# Altium schematic sheet EVK-NORA-W4_SCHEM_0003_USBhub_FTDI.SchDoc
size A3; Date: 04/04/2024; CompanyName: U-blox; DrawnBy: ASOH; Engineer: ASOH; Organization: U-blox; SheetNumber: 4; SheetTotal: 6; SheetSize: B; SheetTitle: Interface MCU
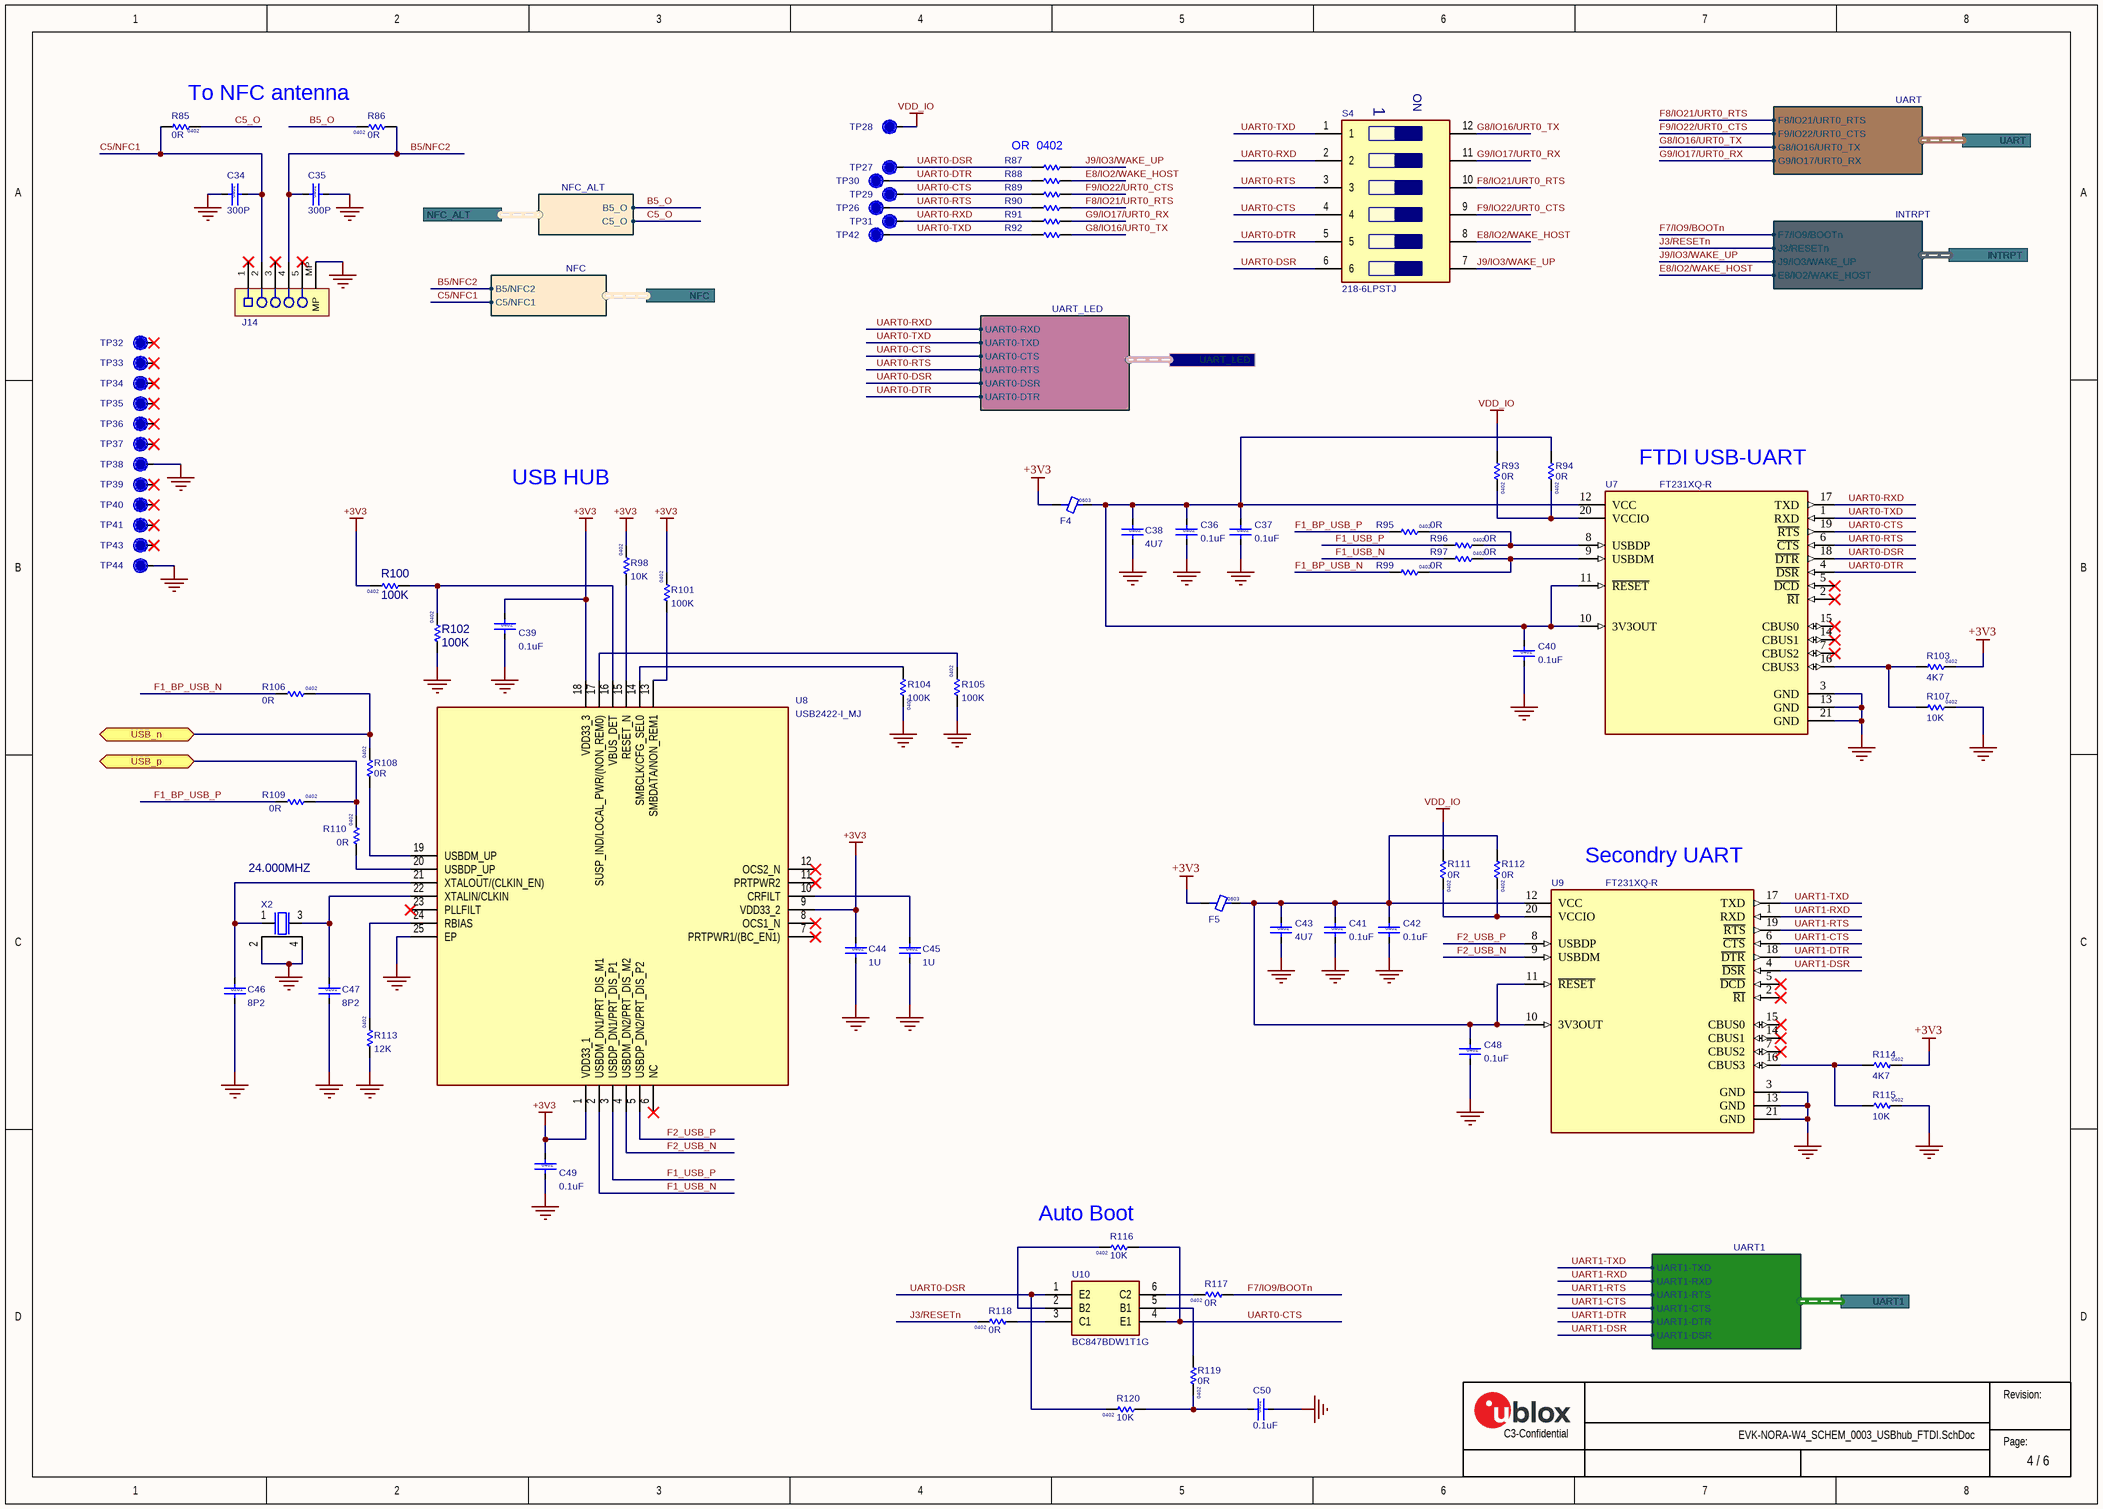
[diagram p0: EVK-NORA-W4_SCHEM_0003_USBhub_FTDI.SchDoc]

## Parts
C34  value 300P  Size: 0402  [Cap 0402 HD]
C35  value 300P  Size: 0402  [Cap 0402 HD]
C36  value 0.1uF  Size: 0402  [Cap 0402 HD]  (hidden comment: 120-000160.1uF)
C37  value 0.1uF  Size: 0402  [Cap 0402 HD]  (hidden comment: 120-000160.1uF)
C38  value 4U7  Size: 0402  [Cap 0402 HD]
C39  value 0.1uF  Size: 0402  [Cap 0402 HD]  (hidden comment: 120-000160.1uF)
C40  value 0.1uF  Size: 0402  [Cap 0402 HD]  (hidden comment: 120-000160.1uF)
C41  value 0.1uF  Size: 0402  [Cap 0402 HD]  (hidden comment: 120-000160.1uF)
C42  value 0.1uF  Size: 0402  [Cap 0402 HD]  (hidden comment: 120-000160.1uF)
C43  value 4U7  Size: 0402  [Cap 0402 HD]
C44  value 1U  Size: 0402  [Cap 0402 HD]
C45  value 1U  Size: 0402  [Cap 0402 HD]
C46  value 8P2  Size: 0201  [Cap 0201 HD]
C47  value 8P2  Size: 0201  [Cap 0201 HD]
C48  value 0.1uF  Size: 0402  [Cap 0402 HD]  (hidden comment: 120-000160.1uF)
C49  value 0.1uF  Size: 0402  [Cap 0402 HD]  (hidden comment: 120-000160.1uF)
C50  value 0.1uF  Size: 0402  [Cap 0402 HD]  (hidden comment: 120-000160.1uF)
F4  Size: 0603  [IND_0603_1750Lx950Wx1050H_600x800Pad_800G_FLX]
F5  Size: 0603  [IND_0603_1750Lx950Wx1050H_600x800Pad_800G_FLX]
J14  UBXH04-0000798  [AVX/Kyocera - 046284005001846]  (value not drawn)
R85  value 0R  Size: 0402  [RES 0402 HD]
R86  value 0R  Size: 0402  [RES 0402 HD]
R87  (no value)  [RES 0402 HD]
R88  (no value)  [RES 0402 HD]
R89  (no value)  [RES 0402 HD]
R90  (no value)  [RES 0402 HD]
R91  (no value)  [RES 0402 HD]
R92  (no value)  [RES 0402 HD]
R93  value 0R  Size: 0402  [RES 0402 HD]
R94  value 0R  Size: 0402  [RES 0402 HD]
R95  value 0R  Size: 0402  [RES 0402 HD]
R96  value 0R  Size: 0402  [RES 0402 HD]
R97  value 0R  Size: 0402  [RES 0402 HD]
R98  value 10K  Size: 0402  [RES 0402 HD]
R99  value 0R  Size: 0402  [RES 0402 HD]
R100  value 100K  Size: 0402  [RES 0402 HD]
R101  value 100K  Size: 0402  [RES 0402 HD]
R102  value 100K  Size: 0402  [RES 0402 HD]
R103  value 4K7  Size: 0402  [RES_0402_1100Lx600Wx400H_500x600Pad_400G_FLX]
R104  value 100K  Size: 0402  [RES 0402 HD]
R105  value 100K  Size: 0402  [RES 0402 HD]
R106  value 0R  Size: 0402  [RES 0402 HD]
R107  value 10K  Size: 0402  [RES_0402_1100Lx600Wx400H_500x600Pad_400G_FLX]
R108  value 0R  Size: 0402  [RES 0402 HD]
R109  value 0R  Size: 0402  [RES 0402 HD]
R110  value 0R  Size: 0402  [RES 0402 HD]
R111  value 0R  Size: 0402  [RES 0402 HD]
R112  value 0R  Size: 0402  [RES 0402 HD]
R113  value 12K  Size: 0402  [RES_0402_1100Lx600Wx400H_500x600Pad_400G_FLX]
R114  value 4K7  Size: 0402  [RES_0402_1100Lx600Wx400H_500x600Pad_400G_FLX]
R115  value 10K  Size: 0402  [RES_0402_1100Lx600Wx400H_500x600Pad_400G_FLX]
R116  value 10K  Size: 0402  [RES 0402 HD]
R117  value 0R  Size: 0402  [RES 0402 HD]
R118  value 0R  Size: 0402  [RES 0402 HD]
R119  value 0R  Size: 0402  [RES 0402 HD]
R120  value 10K  Size: 0402  [RES 0402 HD]
S4  218-6LPSTJ  [2186LPSTJ]
TP26  TP  [TP10R]  (value not drawn)  (no BOM)
TP27  TP  [TP10R]  (value not drawn)  (no BOM)
TP28  TP  [TP10R]  (value not drawn)  (no BOM)
TP29  TP  [TP10R]  (value not drawn)  (no BOM)
TP30  TP  [TP10R]  (value not drawn)  (no BOM)
TP31  TP  [TP10R]  (value not drawn)  (no BOM)
TP32  TP  [TP10R]  (value not drawn)  (no BOM)
TP33  TP  [TP10R]  (value not drawn)  (no BOM)
TP34  TP  [TP10R]  (value not drawn)  (no BOM)
TP35  TP  [TP10R]  (value not drawn)  (no BOM)
TP36  TP  [TP10R]  (value not drawn)  (no BOM)
TP37  TP  [TP10R]  (value not drawn)  (no BOM)
TP38  TP  [TP10R]  (value not drawn)  (no BOM)
TP39  TP  [TP10R]  (value not drawn)  (no BOM)
TP40  TP  [TP10R]  (value not drawn)  (no BOM)
TP41  TP  [TP10R]  (value not drawn)  (no BOM)
TP42  TP  [TP10R]  (value not drawn)  (no BOM)
TP43  TP  [TP10R]  (value not drawn)  (no BOM)
TP44  TP  [TP10R]  (value not drawn)  (no BOM)
U7  FT231XQ-R  [QFN_5x5_FT231XQ]
U8  USB2422-I_MJ  [QFN50P400X400X100-25N-D]
U9  FT231XQ-R  [QFN_5x5_FT231XQ]
U10  BC847BDW1T1G  [SOT65P210X110-6N]
X2  value 24.000MHZ  [XTAL_2016_HD]

## Ports
INTRPT (harness INTRPT), NFC (harness NFC), NFC_ALT (harness NFC_ALT), UART1 (harness UART1), UART (harness UART), UART_LED (harness UART_LED), USB_n (bidir), USB_p (bidir)

## Harnesses
INTRPT: F7/IO9/BOOTn, J3/RESETn, J9/IO3/WAKE_UP, E8/IO2/WAKE_HOST
UART: F8/IO21/URT0_RTS, F9/IO22/URT0_CTS, G8/IO16/URT0_TX, G9/IO17/URT0_RX
NFC_ALT: B5_O, C5_O
NFC: B5/NFC2, C5/NFC1
UART1: UART1-TXD, UART1-RXD, UART1-RTS, UART1-CTS, UART1-DTR, UART1-DSR
UART_LED: UART0-TXD, UART0-CTS, UART0-RTS, UART0-DSR, UART0-DTR, UART0-RXD

## Nets
+3V3: C39.1 C44.1 C49.1 F4.1 F5.1 R98.2 R100.2 R101.2 R103.2 R114.2 U8.1(VDD33_1) U8.9(VDD33_2) U8.18(VDD33_3)
GND: C34.1 C35.2 C36.2 C37.2 C38.2 C39.2 C40.2 C41.2 C42.2 C43.2 C44.2 C45.2 C46.2 C47.2 C48.2 C49.2 C50.2 J14.MP R102.1 R104.2 R105.1 R107.2 R113.1 R115.2 TP38.1 TP44.1 U7.3(GND) U7.13(GND) U7.21(GND) U8.25(EP) U9.3(GND) U9.13(GND) U9.21(GND) X2.2 X2.4
VDD_IO: R93.1 R111.1 TP28.1
B5/NFC2: C35.1 J14.4 R86.1 ; port NFC.B5/NFC2
B5_O: R86.2 ; port NFC_ALT.B5_O
C5/NFC1: C34.2 J14.2 R85.2 ; port NFC.C5/NFC1
C5_O: R85.1 ; port NFC_ALT.C5_O
E8/IO2/WAKE_HOST: R88.2 S4.8 ; port INTRPT.E8/IO2/WAKE_HOST
F1_BP_USB_N: R99.1 R106.1
F1_BP_USB_P: R95.1 R109.1
F1_USB_N: R97.1 U8.2(USBDM_DN1/PRT_DIS_M1)
F1_USB_P: R96.1 U8.3(USBDP_DN1/PRT_DIS_P1)
F2_USB_N: U8.4(USBDM_DN2/PRT_DIS_M2) U9.9(USBDM)
F2_USB_P: U8.5(USBDP_DN2/PRT_DIS_P2) U9.8(USBDP)
F7/IO9/BOOTn: R117.1 ; port INTRPT.F7/IO9/BOOTn
F8/IO21/URT0_RTS: R90.2 S4.10 ; port UART.F8/IO21/URT0_RTS
F9/IO22/URT0_CTS: R89.2 S4.9 ; port UART.F9/IO22/URT0_CTS
G8/IO16/URT0_TX: R92.2 S4.12 ; port UART.G8/IO16/URT0_TX
G9/IO17/URT0_RX: R91.2 S4.11 ; port UART.G9/IO17/URT0_RX
J3/RESETn: R118.2 ; port INTRPT.J3/RESETn
J9/IO3/WAKE_UP: R87.2 S4.7 ; port INTRPT.J9/IO3/WAKE_UP
UART0-CTS: R89.1 R116.1 S4.4 TP29.1 U7.19(~{RTS}) U10.4(E1) ; port UART_LED.UART0-CTS
UART0-DSR: R87.1 R120.2 S4.6 TP27.1 U7.18(~{DTR}) U10.1(E2) ; port UART_LED.UART0-DSR
UART0-DTR: R88.1 S4.5 TP30.1 U7.4(~{DSR}) ; port UART_LED.UART0-DTR
UART0-RTS: R90.1 S4.3 TP26.1 U7.6(~{CTS}) ; port UART_LED.UART0-RTS
UART0-RXD: R91.1 S4.2 TP31.1 U7.17(TXD) ; port UART_LED.UART0-RXD
UART0-TXD: R92.1 S4.1 TP42.1 U7.1(RXD) ; port UART_LED.UART0-TXD
UART1-CTS: U9.6(~{CTS}) ; port UART1.UART1-CTS
UART1-DSR: U9.4(~{DSR}) ; port UART1.UART1-DSR
UART1-DTR: U9.18(~{DTR}) ; port UART1.UART1-DTR
UART1-RTS: U9.19(~{RTS}) ; port UART1.UART1-RTS
UART1-RXD: U9.1(RXD) ; port UART1.UART1-RXD
UART1-TXD: U9.17(TXD) ; port UART1.UART1-TXD
USB_n: R106.2 R108.2 ; port USB_n
USB_p: R109.2 R110.2 ; port USB_p
NetC36_1: C36.1 C37.1 C38.1 C40.1 F4.2 R94.1 U7.10(3V3OUT) U7.11(~{RESET}) U7.12(VCC)
NetC41_1: C41.1 C42.1 C43.1 C48.1 F5.2 R112.1 U9.10(3V3OUT) U9.11(~{RESET}) U9.12(VCC)
NetC45_1: C45.1 U8.10(CRFILT)
NetC46_1: C46.1 U8.21(XTALOUT/(CLKIN_EN)) X2.1
NetC47_1: C47.1 U8.22(XTALIN/CLKIN) X2.3
NetC50_1: C50.1 R119.2 R120.1
NetR93_2: R93.2 R94.2 U7.20(VCCIO)
NetR95_2: R95.2 R96.2 U7.8(USBDP)
NetR97_2: R97.2 R99.2 U7.9(USBDM)
NetR98_1: R98.1 U8.15(RESET_N)
NetR100_1: R100.1 R102.2 U8.16(VBUS_DET)
NetR101_1: R101.1 U8.13(SMBDATA/NON_REM1)
NetR103_1: R103.1 R107.1 U7.16(CBUS3)
NetR104_1: R104.1 U8.14(SMBCLK/CFG_SEL0)
NetR105_2: R105.2 U8.17(SUSP_IND/LOCAL_PWR/(NON_REM0))
NetR108_1: R108.1 U8.19(USBDM_UP)
NetR110_1: R110.1 U8.20(USBDP_UP)
NetR111_2: R111.2 R112.2 U9.20(VCCIO)
NetR113_2: R113.2 U8.24(RBIAS)
NetR114_1: R114.1 R115.1 U9.16(CBUS3)
NetR116_2: R116.2 U10.2(B2)
NetR117_2: R117.2 U10.6(C2)
NetR118_1: R118.1 U10.3(C1)
NetR119_1: R119.1 U10.5(B1)

Not connected (* = marked no-connect by the designer): J14 1* 3* 5*; TP32 1*; TP33 1*; TP34 1*; TP35 1*; TP36 1*; TP37 1*; TP39 1*; TP40 1*; TP41 1*; TP43 1*; U7 2(~{RI})* 5(~{DCD})* 7(CBUS2)* 14(CBUS1)* 15(CBUS0)*; U8 6(NC)* 7(PRTPWR1/(BC_EN1))* 8(OCS1_N)* 11(PRTPWR2)* 12(OCS2_N)* 23(PLLFILT)*; U9 2(~{RI})* 5(~{DCD})* 7(CBUS2)* 14(CBUS1)* 15(CBUS0)*

## Notes on the sheet
- To NFC antenna
- (near R87) OR  0402
- USB HUB
- (near U7) FTDI USB-UART
- (near U9) Secondry UART
- (near R116) Auto Boot
- Revision:
- C3-Confidential
- Page:
- (in symbol 218-6LPSTJ) ON

## Library data of the parts
C34 C35 = UBXH01-0000594: CAP CER C0G 0402 300P 50V; Manufacturer: Murata Manufacturing Company, Ltd.; Manufacturer P/N: GRM1555C1H301JA01D; Editor: eric.moog; Env: ROHS; Permitted Use: Volume Products; Perferred: PREF; Mfg P/N Status: Active; Mfg P/N Split: 100; Mfg P/N Released: No; Part Number: UBXH01-0000594; Max Voltage: 50V; Min Operating Temp: -55°C; Max Operating Temp: 125°C; Part Type: Capacitor; UBX Wiki: https://wiki.u-blox.com/bin/view/Operations/PartDetails?index=38856; RefDes: C
C36 C37 C39-C42 C48-C50 = 120-00016: Cap, Ceramic 0.1uF 10V 10% X5R 0402; Part Name: CAP CER 0.1UF 10V 10% X5R 0402; Part_Type: Ceramic Capacitor; Manufacturer: Murata Electronics North America; Manufacturer P/N: GRM155R61A104KA01J; Item_Phase: Production; Component Mounting Type: SMT; Tolerance: +/- 10%; Use in new designs: Yes; Part Number: 120-00016; Revision: 0A; Supplier 1: Digi-Key; Supplier Part Number 1: 490-6297-1-ND; Manufacturer 2: Yageo; Manufacturer P/N 2: CC0402KRX5R6BB104; Supplier 2: Digi-Key; Supplier Part Number 2: 311-1336-1-ND; Arena Link: https://app.bom.com/a/GYHPV2L2L43KRMBK?v=spec.summary; Height: 0.55mm; Pins: 2; Temperature Coefficient: X5R; Voltage: 10V
C38 C43 = UBXH01-0000243: CAP CER X5R 0402 4U7 20% 10V; Manufacturer: Murata Manufacturing Company, Ltd.; Manufacturer P/N: GRM155R61A475MEAA; Editor: martin.pilik; Released by: fabrice.bret-dibat; Env: GREEN; Permitted Use: Volume Products; Perferred: PREF; Mfg P/N Status: Active; Mfg P/N Split: 100; Mfg P/N Released: Yes; Part Number: UBXH01-0000243; Tolerance: 20%; Max Voltage: 10V; Min Operating Temp: -40°C; Max Operating Temp: 85°C; Part Type: Capacitor; Release Data: 2021-05-10 12:57:47.325652; UBX Wiki: https://wiki.u-blox.com/bin/view/Operations/PartDetails?index=24303; RefDes: C; Mfg P/N Datasheet: https://wiki.u-blox.com/bin/view/Generic/Docs/DocumentSummary?index=24302
C44 C45 = UBXH01-0000248: CAP CER X5R 0402 1U 10% 10V; Manufacturer: Murata Manufacturing Company, Ltd.; Manufacturer P/N: GRM155R61C105KA12; Editor: michael.hein; Released by: igor.shevchenko; Env: ROHS; Permitted Use: Volume Products; Perferred: PREF; Mfg P/N Status: Active; Mfg P/N Split: 100; Mfg P/N Released: Yes; Part Number: UBXH01-0000248; Tolerance: 10%; Max Voltage: 10V; Min Operating Temp: -40°C; Max Operating Temp: 85°C; Part Type: Capacitor; Release Data: 2016-03-16T11:26:35; UBX Wiki: https://wiki.u-blox.com/bin/view/Operations/PartDetails?index=24378; RefDes: C; Mfg P/N Datasheet: https://wiki.u-blox.com/bin/view/Generic/Docs/DocumentSummary?index=29581; Manufacturer 2: TDK Corporation; Manufacturer P/N 2: C1005X5R1E105K050BC; Mfg P/N Status 2: Active; Mfg P/N Split 2: 0; Mfg P/N Released 2: Yes; Mfg P/N Datasheet 2: https://wiki.u-blox.com/bin/view/Generic/Docs/DocumentSummary?index=28058; Manufacturer 3: Samsung Electro-Mechanics; Manufacturer P/N 3: CL05A105KA5NQNC; Mfg P/N Status 3: Active; Mfg P/N Split 3: 0; Mfg P/N Released 3: Yes; Mfg P/N Datasheet 3: https://wiki.u-blox.com/bin/view/Generic/Docs/DocumentSummary?index=28056
C46 C47 = UBXH01-0013002: CAP CER C0G 0201 8P2 +/-0.5P 25V; Manufacturer: Murata Manufacturing Company, Ltd.; Manufacturer P/N: GRM0335C1E8R2DA01; Editor: roland.rust; Env: ROHS; Permitted Use: Volume Products; Perferred: PREF; Mfg P/N Status: Active; Mfg P/N Split: 100; Mfg P/N Released: Yes; Part Number: UBXH01-0013002; Tolerance: +/-0.5P; Max Voltage: 25V; Part Type: Capacitor; Released by: roland.rust; Release Data: 2009-03-23T10:34:14; UBX Wiki: https://wiki.u-blox.com/bin/view/Operations/PartDetails?index=5090; RefDes: C; Manufacturer 2: Murata Manufacturing Company, Ltd.; Manufacturer P/N 2: GRM0335C1E8R2D; Mfg P/N Status 2: Active; Mfg P/N Split 2: 0; Mfg P/N Released 2: Obsolete
F4 F5 = UBXH08-0000001: FERRITE BEAD 0603 600 OHM AT 100MHZ 600OHM 500mA; Manufacturer: TDK Corporation; Manufacturer P/N: MMZ1608B601C; Editor: daniel.hurni; Released by: martin.frauchiger; Env: ROHS; Permitted Use: Support Products; Perferred: PREF; Mfg P/N Status: Active; Mfg P/N Split: 100; Mfg P/N Released: Yes; Part Number: UBXH08-0000001; Value: 600OHM; Max Current: 500mA; Min Operating Temp: -40°C; Max Operating Temp: 125°C; Part Type: Ferrite; Release Data: 2009-12-02T10:18:36; UBX Wiki: https://wiki.u-blox.com/bin/view/Operations/PartDetails?index=7960; RefDes: FB; Mfg P/N Datasheet: https://wiki.u-blox.com/bin/view/Generic/Docs/DocumentSummary?index=7941
J14 = UBXH04-0000798: 0.50MM PITCH SMD RA FFC FPC CONN 5 -PIN 50V 400mA; Manufacturer P/N: 046284005001846; Part Name: CON FFC/FPC 0.50mm 5Pos R/A; Part_Type: Connector; Manufacturer 1: KYOCERA AVX; Manufacturer: AVX; Item_Phase: Preliminary; Component Mounting Type: SMT; Keyed: No; Pin Pitch: 0.5mm; Rows: 1; Use in new designs: Yes; Value: 046284005001846; Editor: eric.moog; Env: ROHS; Permitted Use: Support Products; Perferred: PREF; Mfg P/N Status: Active; Mfg P/N Split: 100; Part Number: UBXH04-0000798; Color: White; Connector Type: FPC; Height: 1.3mm; Length: 4.05mm; Locking: No; Pins: 5; Voltage: 50V; Width: 4.4mm; Manufacturer Part Number 1: 046284005001846; Max Voltage: 50V; Max Current: 400mA; Min Operating Temp: -40°C; Max Operating Temp: 85°C; Part Type: Connector; UBX Wiki: https://wiki.u-blox.com/bin/view/Operations/PartDetails?index=38822; RefDes: J; Mfg P/N Released: No; Mfg P/N Datasheet: https://wiki.u-blox.com/bin/view/Generic/Docs/DocumentSummary?index=38862
R85 R86 R93 R94 R111 R112 R117-R119 = UBXH18-0003002: RES THICK FILM CHIP 0402 0R 0 100mW; Manufacturer: KOA; Manufacturer P/N: RK73Z1ETTP; Tolerance: 0; Editor: charlotte.biber; Released by: peter.mueller; Env: ROHS; Permitted Use: Volume Products; Perferred: PREF; Mfg P/N Status: NRND; Mfg P/N Split: 100; Mfg P/N Released: Yes; Part Number: UBXH18-0003002; Max Power: 100mW; Part Type: Resistor; Release Data: 2012-06-05 09:49:55.978616; UBX Wiki: https://wiki.u-blox.com/bin/view/Operations/PartDetails?index=6611; RefDes: R; Manufacturer 2: YAGEO; Manufacturer P/N 2: 2322_705_91001_L; Mfg P/N Status 2: NRND; Mfg P/N Split 2: 0; Mfg P/N Released 2: Yes
R87-R92 R95-R97 R99 R106 R108-R110 = UBXH18-0003002: RES THICK FILM CHIP 0402 0R 0 100mW; Manufacturer: KOA; Manufacturer P/N: RK73Z1ETTD; Tolerance: 0; Editor: charlotte.biber; Released by: peter.mueller; Env: ROHS; Permitted Use: Volume Products; Perferred: PREF; Mfg P/N Status: NRND; Mfg P/N Split: 100; Mfg P/N Released: Yes; Part Number: UBXH18-0003002; Max Power: 100mW; Part Type: Resistor; Release Data: 2012-06-05 09:49:55.978616; UBX Wiki: https://wiki.u-blox.com/bin/view/Operations/PartDetails?index=6611; RefDes: R; Manufacturer 2: YAGEO; Manufacturer P/N 2: 2322_705_91001_L; Mfg P/N Status 2: NRND; Mfg P/N Split 2: 0; Mfg P/N Released 2: Yes
  R87-R92: Value: 0R; Size: 0402
R98 R116 R120 = UBXH18-0000065: RES THICK FILM CHIP 0402 10K 1% 63mW; Manufacturer: KOA; Manufacturer P/N: RK73H1ETTP1002F; Editor: erian.bezhani; Released by: massimo.vlacci; Env: ROHS; Permitted Use: Volume Products; Perferred: PREF; Mfg P/N Status: Active; Mfg P/N Split: 100; Mfg P/N Released: Yes; Part Number: UBXH18-0000065; Tolerance: 1%; Max Power: 63mW; Part Type: Resistor; Release Data: 2012-06-08 18:02:21.521517; UBX Wiki: https://wiki.u-blox.com/bin/view/Operations/PartDetails?index=16837; RefDes: R; Mfg P/N Datasheet: https://wiki.u-blox.com/bin/view/Generic/Docs/DocumentSummary?index=8222
R100-R102 R104 R105 = UBXH18-0000005: RES THICK FILM CHIP 0402 100K 1% 63mW; Manufacturer: KOA; Manufacturer P/N: RK73H1ETTP1003F; Editor: dario.antonaz; Released by: sandro.sestan; Env: ROHS; Permitted Use: Volume Products; Mfg P/N Status: Active; Mfg P/N Split: 100; Mfg P/N Released: Yes; Part Number: UBXH18-0000005; Tolerance: 1%; Max Power: 63mW; Part Type: Resistor; Release Data: 2009-11-30T11:05:22; UBX Wiki: https://wiki.u-blox.com/bin/view/Operations/PartDetails?index=8114; Perferred: N/A; RefDes: R; Mfg P/N Datasheet: https://wiki.u-blox.com/bin/view/Generic/Docs/DocumentSummary?index=8222; Manufacturer 2: ROHM; Manufacturer P/N 2: MCR01MZPF1003; Mfg P/N Status 2: Obsolete; Mfg P/N Split 2: 0; Mfg P/N Released 2: Yes; Mfg P/N Datasheet 2: https://wiki.u-blox.com/bin/view/Generic/Docs/DocumentSummary?index=8186
R103 R114 = UBXH18-0008065: RES THICK FILM CHIP 0402 4K7 5% 100mW; Manufacturer: YAGEO; Manufacturer P/N: 2322_705_70472_L; Editor: martin.frauchiger; Env: ROHS; Permitted Use: Volume Products; Perferred: PREF; Mfg P/N Status: Obsolete; Mfg P/N Split: 100; Mfg P/N Released: Yes; Part Number: UBXH18-0008065; Tolerance: 5%; Max Power: 100mW; Part Type: Resistor; Released by: martin.frauchiger; Release Data: 2005-08-19T10:42:45; UBX Wiki: https://wiki.u-blox.com/bin/view/Operations/PartDetails?index=6969; RefDes: R; Manufacturer 2: KOA; Manufacturer P/N 2: RK73B1ETTD472J; Mfg P/N Status 2: NRND; Mfg P/N Split 2: 0; Mfg P/N Released 2: Yes
R107 R115 = UBXH18-0008073: RES THICK FILM CHIP 0402 10K 5% 100mW; Manufacturer: KOA; Manufacturer P/N: RK73B1ETTD103J; Editor: martin.frauchiger; Env: ROHS; Permitted Use: Volume Products; Perferred: PREF; Mfg P/N Status: NRND; Mfg P/N Split: 100; Mfg P/N Released: Yes; Part Number: UBXH18-0008073; Tolerance: 5%; Max Power: 100mW; Part Type: Resistor; Released by: martin.frauchiger; Release Data: 2005-08-19T10:42:45; UBX Wiki: https://wiki.u-blox.com/bin/view/Operations/PartDetails?index=6981; RefDes: R; Manufacturer 2: YAGEO; Manufacturer P/N 2: RC0402JR-0710KL; Mfg P/N Status 2: Active; Mfg P/N Split 2: 0; Mfg P/N Released 2: No; Manufacturer 3: YAGEO; Manufacturer P/N 3: 2322_705_87103_L; Mfg P/N Status 3: Obsolete; Mfg P/N Split 3: 0; Mfg P/N Released 3: Yes
R113 = UBXH18-0000133: RES THICK FILM CHIP 0402 12K 1% 62.5mW; Manufacturer: YAGEO; Manufacturer P/N: RT0402FRE0712KL; Editor: pierpaolo.arban; Released by: dario.antonaz; Env: ROHS; Permitted Use: Volume Products; Perferred: PREF; Mfg P/N Status: Active; Mfg P/N Split: 100; Mfg P/N Released: Yes; Part Number: UBXH18-0000133; Tolerance: 1%; Max Power: 62.5mW; Min Operating Temp: -55°C; Max Operating Temp: 155°C; Part Type: Resistor; Release Data: 2019-11-07T09:33:25; UBX Wiki: https://wiki.u-blox.com/bin/view/Operations/PartDetails?index=20511; RefDes: R; Mfg P/N Datasheet: https://wiki.u-blox.com/bin/view/Generic/Docs/DocumentSummary?index=19276
S4 = 218-6LPSTJ: Switch; Manufacturer_Name: CTS; Datasheet Link: https://www.ctscorp.com/wp-content/uploads/218.pdf; Height: 2.7mm; Manufacturer_Part_Number: 218-6LPSTJ; Mouser Part Number: 774-2186LPSTJ; Mouser Price/Stock: https://www.mouser.co.uk/ProductDetail/CTS-Electronic-Components/218-6LPSTJ?qs=hDoPxpGr7lflvoQJzlrOfA%3D%3D; Arrow Part Number: 218-6LPSTJ; Arrow Price/Stock: https://www.arrow.com/en/products/218-6lpstj/cts
TP26-TP44 = TP10R: Testpoint, Round 1.0mm Dia; Added By: Jeremy D; Part Number: TP10R; Size: 1.0mm; Height: 0; DNP: DNP; Added Date: 2/1/2015; Checked By: Paul B; Checked Date: 2/5/2015
U7 U9 = UBXH10-0000054: FTDI USB TO SERIAL FULL UART INTERFACE QFN20; Manufacturer: FTDI Future Technology Devices International; Editor: adam.johansson; Env: ROHS; Permitted Use: Support Products; Perferred: PREF; Mfg P/N Status: Active; Mfg P/N Split: 100; Mfg P/N Released: No; Part Number: UBXH10-0000054; Value: FT231XQ-R; Min Operating Temp: -40°C; Max Operating Temp: 85°C; Part Type: Interface; UBX Wiki: https://wiki.u-blox.com/bin/view/Operations/PartDetails?index=27258; RefDes: U; Manufacturer P/N: FT231XQ-R; Mfg P/N Datasheet: https://wiki.u-blox.com/bin/view/Generic/Docs/DocumentSummary?index=33707
U8 = USB2422-I_MJ: Integrated Circuit; Manufacturer_Name: Microchip; Manufacturer_Part_Number: USB2422-I/MJ; Datasheet Link: https://datasheet.datasheetarchive.com/originals/distributors/DKDS-15/280029.pdf; Height: 1mm; Mouser Part Number: 579-USB2422-I/MJ; Mouser Price/Stock: https://www.mouser.co.uk/ProductDetail/Microchip-Technology-Atmel/USB2422-I-MJ?qs=eTPcRhULBzzm1uvzgv8YJg%3D%3D; Arrow Part Number: USB2422-I/MJ; Arrow Price/Stock: https://www.arrow.com/en/products/usb2422-imj/microchip-technology?region=nac
U10 = BC847BDW1T1G: Integrated Circuit; Manufacturer_Name: onsemi; Datasheet Link: http://www.onsemi.com/pub/Collateral/BC846BDW1T1-D.PDF; Height: 1.1mm; Manufacturer_Part_Number: BC847BDW1T1G; Mouser Part Number: 863-BC847BDW1T1G; Mouser Price/Stock: https://www.mouser.co.uk/ProductDetail/onsemi/BC847BDW1T1G?qs=vNc2DXHODiJIIkxW3oEo4A%3D%3D; Arrow Part Number: BC847BDW1T1G; Arrow Price/Stock: https://www.arrow.com/en/products/bc847bdw1t1g/on-semiconductor?region=europe
X2 = UBXH21-0000066: CRYSTAL CL=8PF EPSON 2.0X1.6MM 24.000MHZ 30PPM; Manufacturer: Seiko Epson Corporation; Manufacturer P/N: Q22FA1280046700; Editor: adam.johansson; Released by: olof.viklund; Critical: Yes; Env: ROHS; Permitted Use: Volume Products; Perferred: PREF; Mfg P/N Status: Active; Mfg P/N Split: 100; Part Number: UBXH21-0000066; Tolerance: 30PPM; Min Operating Temp: -40°C; Max Operating Temp: 85°C; Part Type: Crystal; Release Data: 2015-11-11T10:35:48; UBX Wiki: https://wiki.u-blox.com/bin/view/Operations/PartDetails?index=21963; RefDes: Y; Mfg P/N Released: Yes; Mfg P/N Datasheet: https://wiki.u-blox.com/bin/view/Generic/Docs/DocumentSummary?index=23017; Manufacturer 2: Seiko Epson Corporation; Manufacturer P/N 2: Q22FA1280039800; Mfg P/N Status 2: Obsolete; Mfg P/N Split 2: 0; Mfg P/N Released 2: Obsolete; Mfg P/N Datasheet 2: https://wiki.u-blox.com/bin/view/Generic/Docs/DocumentSummary?index=21965